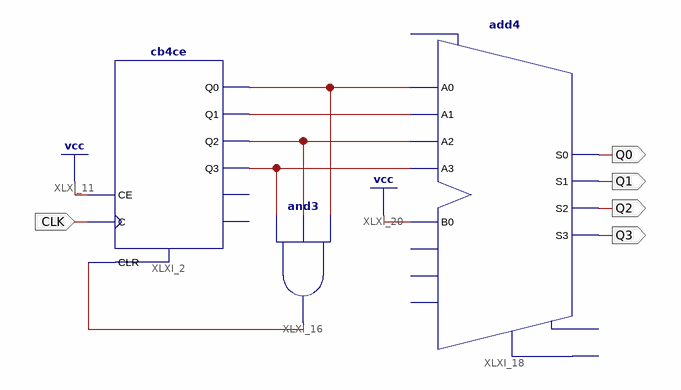
[diagram p0: schematic sheet 1]
// Xilinx ISE schematic oneto13cnt.sch (spartan3) as structural Verilog: 3 symbols, 5 ports
module oneto13cnt (
  input  CLK,
  output Q0,
  output Q1,
  output Q2,
  output Q3
);

  wire XLXN_11, XLXN_13, XLXN_14, XLXN_30, XLXN_31;

  cb4ce XLXI_2 (
    .C(CLK), .CE(1'b1), .CLR(XLXN_30), .Q0(XLXN_11), .Q1(XLXN_31), .Q2(XLXN_13), .Q3(XLXN_14));  // open: CEO, TC
  and XLXI_16 (XLXN_30, XLXN_14, XLXN_13, XLXN_11);
  add4 XLXI_18 (
    .A0(XLXN_11), .A1(XLXN_31), .A2(XLXN_13), .A3(XLXN_14), .B0(1'b1), .S0(Q0), .S1(Q1), .S2(Q2), .S3(Q3));  // open: B1, B2, B3, CI, CO, OFL
endmodule
